# EAGLE design iot_ambilamp (EAGLE 9.1.3)
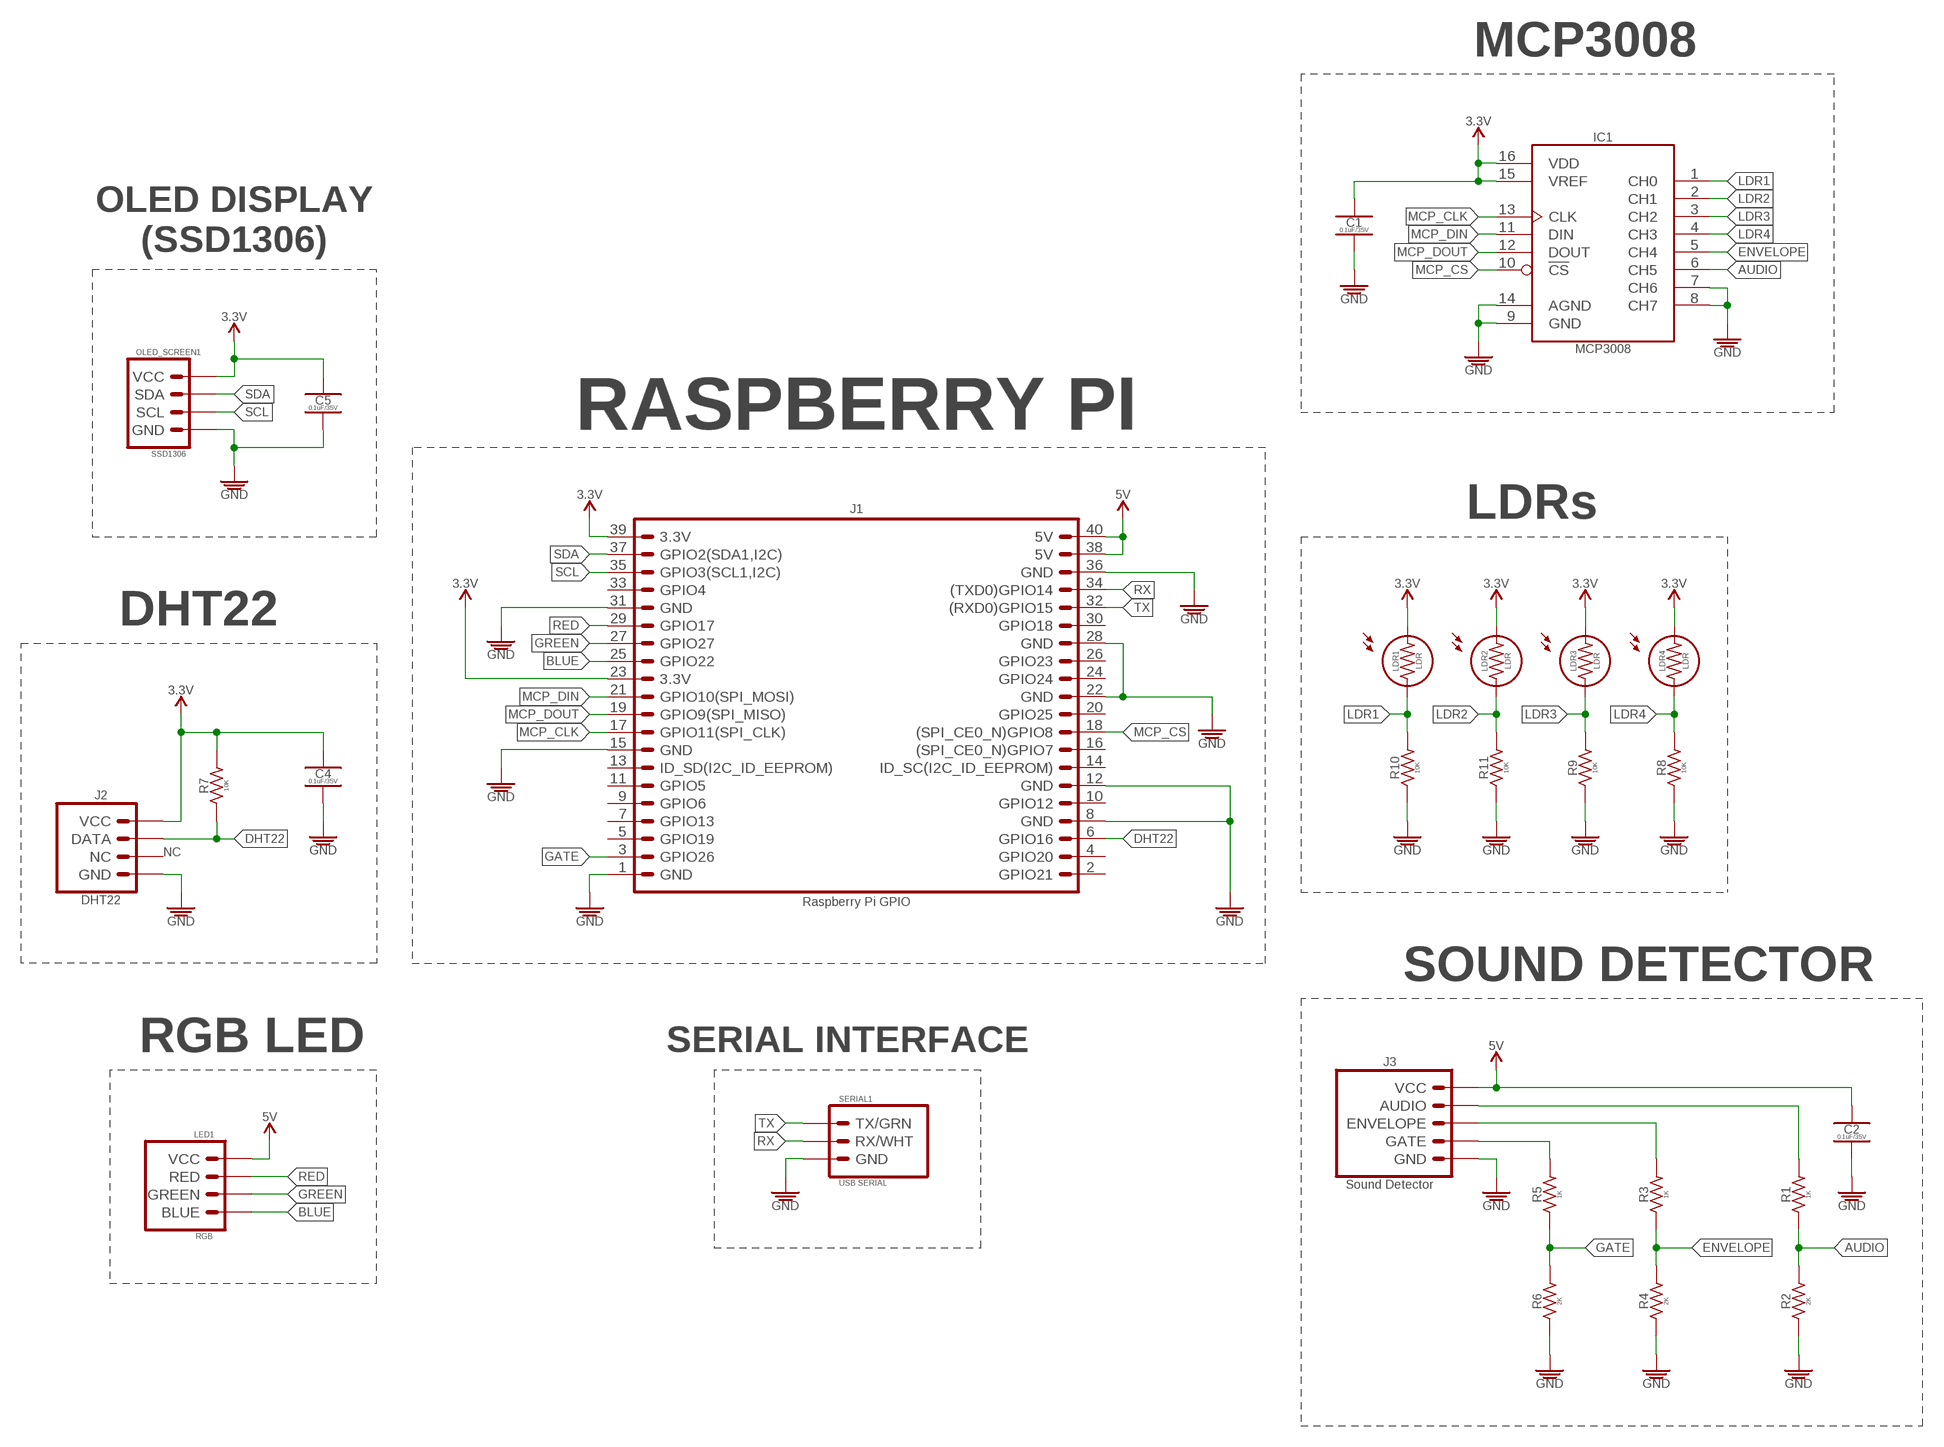
[diagram p0: schematic, sheet 1]

## Parts
C1  0.1uF/35V  0.1UF_SMD-0805_35V-10%  [CAPC2012X95_SMD-0805]
C2  0.1uF/35V  0.1UF_SMD-0805_35V-10%  [CAPC2012X95_SMD-0805]
C4  0.1uF/35V  0.1UF_SMD-0805_35V-10%  [CAPC2012X95_SMD-0805]
C5  0.1uF/35V  0.1UF_SMD-0805_35V-10%  [CAPC2012X95_SMD-0805]
IC1  MCP3008  MCP3008_ADC_8-CH_10-BIT_SOIC-16  [SOIC127P600X175-16]
J1  Raspberry Pi GPIO  RPI-GPIO_CONNECTOR_PTH_VERT_FEMALE_2.54MM  [HDRVR40W64P254_2X20_5130X500X1350B]
J2  DHT22  TEMPERATURE-SENSOR_DHT22_DHT22_AM2302_TEMPERATURE-HUMIDITY  [TEMPERATURE-SENSOR_DHT22]
J3  Sound Detector  SOUND-DETECTOR_SPARKFUN_BREAKOUT_PTH_VERT_MALE_2.54MM  [HDRV5W64P254_1X5_1270X254X838B]
LDR1  LDR  PHOTORESISTOR_5MM_TALL  [PHOTORESISTOR_TALL]
LDR2  LDR  PHOTORESISTOR_5MM_TALL  [PHOTORESISTOR_TALL]
LDR3  LDR  PHOTORESISTOR_5MM_TALL  [PHOTORESISTOR_TALL]
LDR4  LDR  PHOTORESISTOR_5MM_TALL  [PHOTORESISTOR_TALL]
LED1  RGB  LED-5MM-PTH_RGB-CA_PTH_VERT_FEMALE_2.54MM  [HDRVR4W75P254_1X4_1066X254X850B]
OLED_SCREEN1  SSD1306  SSD1306_OLED_SCREEN_0.96IN_W128-H64_PTH_VERT_MALE_2.54MM  [HDRV4W64P254_1X4_1016X254X838B]
R1  1K  1KΩ_SMD-0805_1/8W-5%  [RESC2012X60_SMD-0805]
R2  2K  2KΩ_SMD-0805_1.8W-5%  [RESC2012X60_SMD-0805]
R3  1K  1KΩ_SMD-0805_1/8W-5%  [RESC2012X60_SMD-0805]
R4  2K  2KΩ_SMD-0805_1.8W-5%  [RESC2012X60_SMD-0805]
R5  1K  1KΩ_SMD-0805_1/8W-5%  [RESC2012X60_SMD-0805]
R6  2K  2KΩ_SMD-0805_1.8W-5%  [RESC2012X60_SMD-0805]
R7  10K  10KΩ_SMD-0805_1/8W-5%  [RESC2012X60_SMD-0805]
R8  10K  10KΩ_SMD-0805_1/8W-5%  [RESC2012X60_SMD-0805]
R9  10K  10KΩ_SMD-0805_1/8W-5%  [RESC2012X60_SMD-0805]
R10  10K  10KΩ_SMD-0805_1/8W-5%  [RESC2012X60_SMD-0805]
R11  10K  10KΩ_SMD-0805_1/8W-5%  [RESC2012X60_SMD-0805]
SERIAL1  USB SERIAL  USB_SERIAL_CABLE_PL-2303_3.3V_PTH_VERT_MALE_2.54MM_NO-PWR  [HDRV3W64P254_1X3_762X254X838B_USB-SERIAL-CABLE]

## Nets
3.3V: C1.1 C4.1 C5.1 IC1.15(VREF) IC1.16(VDD) J1.23(3.3V) J1.39(3.3V) J2.VCC LDR1.P$2 LDR2.P$2 LDR3.P$2 LDR4.P$2 OLED_SCREEN1.VCC R7.2
5V: C2.1 J1.38(5V) J1.40(5V) J3.VCC LED1.VCC
AUDIO: IC1.6(CH5) R1.1 R2.2
BLUE: J1.25(GPIO22) LED1.BLUE
DHT22: J1.6(GPIO16) J2.DATA R7.1
ENVELOPE: IC1.5(CH4) R3.1 R4.2
GATE: J1.3(GPIO26) R5.1 R6.2
GND: C1.2 C2.2 C4.2 C5.2 IC1.7(CH6) IC1.8(CH7) IC1.9(GND) IC1.14(AGND) J1.1(GND) J1.8(GND) J1.12(GND) J1.15(GND) J1.22(GND) J1.28(GND) J1.31(GND) J1.36(GND) J2.GND J3.GND OLED_SCREEN1.GND R2.1 R4.1 R6.1 R8.1 R9.1 R10.1 R11.1 SERIAL1.GND
GREEN: J1.27(GPIO27) LED1.GREEN
LDR1: IC1.1(CH0) LDR1.P$1 R10.2
LDR2: IC1.2(CH1) LDR2.P$1 R11.2
LDR3: IC1.3(CH2) LDR3.P$1 R9.2
LDR4: IC1.4(CH3) LDR4.P$1 R8.2
MCP_CLK: IC1.13(CLK) J1.17(GPIO11(SPI_CLK))
MCP_CS: IC1.10(!CS) J1.18((SPI_CE0_N)GPIO8)
MCP_DIN: IC1.11(DIN) J1.21(GPIO10(SPI_MOSI))
MCP_DOUT: IC1.12(DOUT) J1.19(GPIO9(SPI_MISO))
N$9: J3.AUDIO R1.2
N$13: J3.ENVELOPE R3.2
N$14: J3.GATE R5.2
RED: J1.29(GPIO17) LED1.RED
RX: J1.34((TXD0)GPIO14) SERIAL1.RX/WHT
SCL: J1.35(GPIO3(SCL1,I2C)) OLED_SCREEN1.SCL
SDA: J1.37(GPIO2(SDA1,I2C)) OLED_SCREEN1.SDA
TX: J1.32((RXD0)GPIO15) SERIAL1.TX/GRN
Unconnected: J1.2(GPIO21) J1.4(GPIO20) J1.5(GPIO19) J1.7(GPIO13) J1.9(GPIO6) J1.10(GPIO12) J1.11(GPIO5) J1.13(ID_SD(I2C_ID_EEPROM)) J1.14(ID_SC(I2C_ID_EEPROM)) J1.16((SPI_CE0_N)GPIO7) J1.20(GPIO25) J1.24(GPIO24) J1.26(GPIO23) J1.30(GPIO18) J1.33(GPIO4) J2.NC

## Notes on the sheet
- MCP3008
- OLED DISPLAY
  (SSD1306)
- RASPBERRY PI
- LDRs
- DHT22
- SOUND DETECTOR
- RGB LED | SERIAL INTERFACE

## Library data of the parts
C1 C2 C4 C5 = PiB_capacitors:0.1UF; DATASHEET: http://ds.yuden.co.jp/TYCOMPAS/ut/detail.do?productNo=GMK212BJ104KGHT&fileName=GMK212BJ104KGHT_SS&mode=specSheetDownload; DIST: Digikey; DISTLINK: https://www.digikey.com/products/en?keywords=587-3364-1-ND; DISTPN: 587-3364-1-ND; MFR: Taiyo Yuden; MPN: GMK212BJ104KGHT
IC1 = PiB:MCP3008; DATASHEET: http://ww1.microchip.com/downloads/en/DeviceDoc/21295d.pdf; DIST: Digikey; DISTLINK: https://www.digikey.com/products/en?keywords=MCP3008-I%2FSL-ND; DISTPN: MCP3008-I/SL-ND; MFR: Microchip Technology; MPN: MCP3008-I/SL
J1 = PiB_connectors:RPI-GPIO_CONNECTOR; DATASHEET: https://cdn.sparkfun.com/datasheets/Dev/RaspberryPi/12313.pdf; DIST: Digikey; DISTLINK: https://www.digikey.com/products/en?keywords=1568-1462-ND; DISTPN: 1568-1462-ND; MFR: SparkFun Electronics; MPN: PRT-14017
J2 = PiB_sensors:TEMPERATURE-SENSOR_DHT22; DATASHEET: https://cdn-learn.adafruit.com/downloads/pdf/dht.pdf; DIST: Digikey; DISTLINK: https://www.digikey.com/products/en?keywords=1528-1504-ND; DISTPN: 1528-1504-ND; MFR: Adafruit Industries LLC; MPN: 385
J3 = PiB_sound:SOUND-DETECTOR_SPARKFUN; DATASHEET: https://media.digikey.com/pdf/Data%20Sheets/Sparkfun%20PDFs/SoundDetector_HookupGuide.pdf; DATASHEET_CONNECTOR: https://drawings-pdf.s3.amazonaws.com/C10436.pdf; DIST: Digikey; DISTLINK: https://www.digikey.com/products/en?keywords=1568-1290-ND; DISTLINK_CONNECTOR: https://www.digikey.com/products/en?keywords=PEC05SAAN; DISTPN: 1568-1290-ND; DISTPN_CONNECTOR: S1012E-05-ND; DIST_CONNECTOR: Digikey; MFR: SparkFun Electronics; MFR_CONNECTOR: Sullins Connector Solutions; MPN: SEN-12642; MPN_CONNECTOR: PEC05SAAN
LDR1-LDR4 = PiB_sensors:PHOTORESISTOR; DATASHEET: https://cdn-learn.adafruit.com/downloads/pdf/photocells.pdf; DIST: Digikey; DISTLINK: https://www.digikey.com/products/en?keywords=1528-2141-ND; DISTPN: 1528-2141-ND; MFR: Adafruit Industries LLC; MPN: 161
LED1 = PiB_leds:LED-5MM-PTH_RGB-CA; DATASHEET: N/A; DATASHEET_CONNECTOR: https://drawings-pdf.s3.amazonaws.com/10492.pdf; DIST: Amazon; DISTLINK: https://www.amazon.com/Tricolor-Multicolor-Lighting-Electronics-Components/dp/B01C19ENFK/ref=sr_1_1?ie=UTF8&qid=1504314575&sr=8-1&keywords=RGB+Clear+Common+Anode; DISTLINK_CONNECTOR: https://www.digikey.com/products/en?mpart=PPPC041LFBN-RC&v=35; DISTPN: B01C19ENFK; DISTPN_CONNECTOR: S7037-ND; DIST_CONNECTOR: Digikey; MFR: Chanzon; MFR_CONNECTOR: Sullins Connector Solutions; MPN: 100F5T-YT-RGB-CA; MPN_CONNECTOR: PPPC041LFBN-RC
OLED_SCREEN1 = PiB_displays:SSD1306_OLED_SCREEN; DATASHEET: https://cdn-shop.adafruit.com/datasheets/SSD1306.pdf; DATASHEET_CONNECTOR: https://drawings-pdf.s3.amazonaws.com/C10436.pdf; DIST: Amazon; DISTLINK: https://www.amazon.com/Serial-Display-Module-Arduino-MakerFocus/dp/B076WXR8N9/ref=sr_1_4?s=electronics&ie=UTF8&qid=1522732901&sr=1-4&keywords=0.96+inch+OLED+Display+Module; DISTLINK_CONNECTOR: https://www.digikey.com/products/en?keywords=PEC04SAAN; DISTPN: B076WXR8N9; DISTPN_CONNECTOR: S1012E-04-ND; DIST_CONNECTOR: Digikey; MFR: Makerfocus; MFR_CONNECTOR: Sullins Connector Solutions; MPN: SSD1306; MPN_CONNECTOR: PEC04SAAN
R1 R3 R5 = PiB_resistors:1KΩ; DATASHEET: http://www.yageo.com/documents/recent/PYu-RC_Group_51_RoHS_L_9.pdf; DIST: Digikey; DISTLINK: https://www.digikey.com/products/en?keywords=311-1.0KARCT-ND; DISTPN: 311-1.0KARCT-ND; MFR: Yageo; MPN: RC0805JR-071KL
R2 R4 R6 = PiB_resistors:2KΩ; DATASHEET: http://www.yageo.com/documents/recent/PYu-RC_Group_51_RoHS_L_9.pdf; DIST: Digikey; DISTLINK: https://www.digikey.com/products/en?keywords=311-2.0KARCT-ND; DISTPN: 311-2.0KARCT-ND; MFR: Yageo; MPN: RC0805JR-072KL
R7-R11 = PiB_resistors:10KΩ; DATASHEET: http://www.yageo.com/documents/recent/PYu-RC_Group_51_RoHS_L_9.pdf; DIST: Digikey; DISTLINK: https://www.digikey.com/products/en?keywords=311-10KARCT-ND; DISTPN: 311-10KARCT-ND; MFR: Yageo; MPN: RC0805JR-0710KL
SERIAL1 = PiB_connectors:USB_SERIAL_CABLE; DATASHEET: https://media.digikey.com/pdf/Data%20Sheets/Adafruit%20PDFs/954_Web.pdf; DATASHEET_CONNECTOR: https://drawings-pdf.s3.amazonaws.com/C10436.pdf; DIST: Digikey; DISTLINK: https://www.digikey.com/products/en?keywords=1528-2128-ND; DISTLINK_CONNECTOR: https://www.digikey.com/products/en?keywords=PEC03SAAN; DISTPN: 1528-2128-ND; DISTPN_CONNECTOR: S1012E-03-ND; DIST_CONNECTOR: Digikey; MFR: Adafruit Industries LLC; MFR_CONNECTOR: Sullins Connector Solutions; MPN: 954; MPN_CONNECTOR: PEC03SAAN

## Board
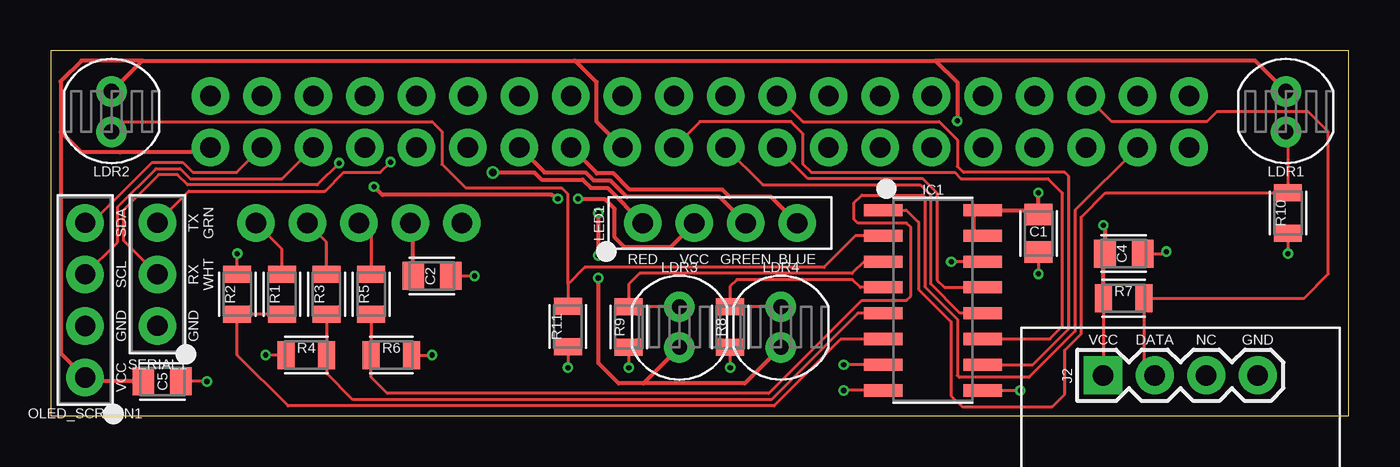
[diagram p1: board, top side]
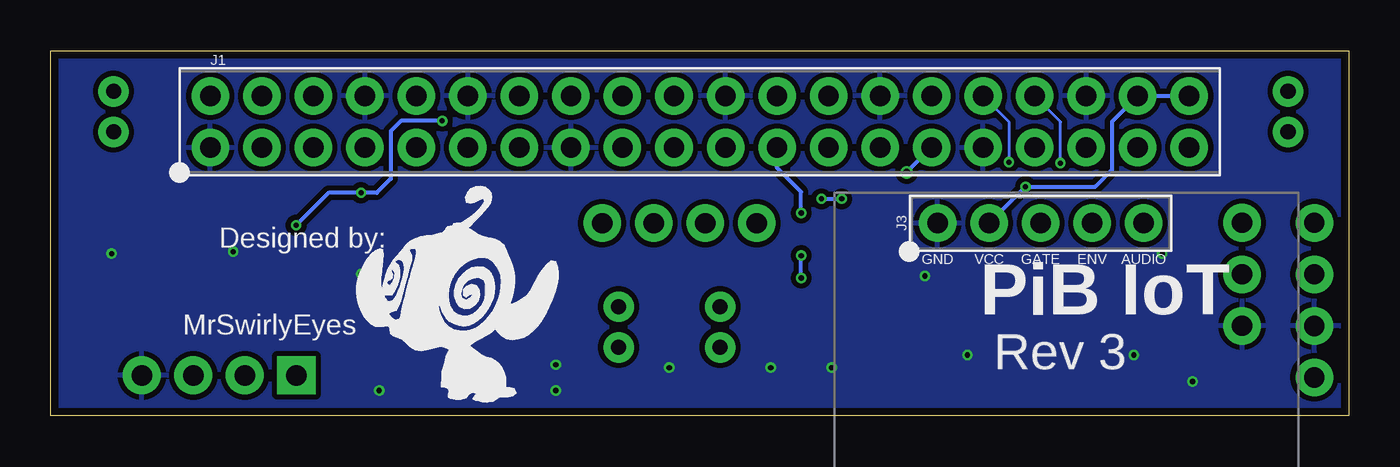
[diagram p2: board, bottom side, seen from below]

Size 64 x 18 mm. Coordinates in mm from the lower left corner, seen from the top.
Outline: 64,0 64,18 0,18 0,0 64,0
Copper layers (1*16): Top 0.035559375mm / dielectric 1.6mm / Bottom 0.035559375mm
Design rules "oshpark-2layer": minimum track width 6mil, minimum drill 10mil, track to track 6mil, track to pad 6mil, pad to pad 6mil, via to via 6mil, smd to smd 6mil, copper to edge 15mil, drill to drill 6mil, minimum pad ring 5mil, minimum via ring 5mil, stop-mask expansion 2.5mil, vias tented up to drill 0mil, thermal gap 10mil

### Footprints (pad centres in the part's own frame; a part is rotated, then mirrored left to right if it is on the bottom)
CAPC2012X95_SMD-0805 = smd 1.065 x 1.379: 1 -0.925,0; 2 0.925,0
SOIC127P600X175-16 = smd 1.901 x 0.599: 1 -2.455,4.445; 2 -2.455,3.175; 3 -2.455,1.905; 4 -2.455,0.635; 5 -2.455,-0.635; 6 -2.455,-1.905; 7 -2.455,-3.175; 8 -2.455,-4.445; 9 2.455,-4.445; 10 2.455,-3.175; 11 2.455,-1.905; 12 2.455,-0.635; 13 2.455,0.635; 14 2.455,1.905; 15 2.455,3.175; 16 2.455,4.445
HDRVR40W64P254_2X20_5130X500X1350B = drill 1 pad 1.85: 1 0,0; 2 0,2.54; 3 2.54,0; 4 2.54,2.54; 5 5.08,0; 6 5.08,2.54; 7 7.62,0; 8 7.62,2.54; 9 10.16,0; 10 10.16,2.54; 11 12.7,0; 12 12.7,2.54; 13 15.24,0; 14 15.24,2.54; 15 17.78,0; 16 17.78,2.54; 17 20.32,0; 18 20.32,2.54; 19 22.86,0; 20 22.86,2.54; 21 25.4,0; 22 25.4,2.54; 23 27.94,0; 24 27.94,2.54; 25 30.48,0; 26 30.48,2.54; 27 33.02,0; 28 33.02,2.54; 29 35.56,0; 30 35.56,2.54; 31 38.1,0; 32 38.1,2.54; 33 40.64,0; 34 40.64,2.54; 35 43.18,0; 36 43.18,2.54; 37 45.72,0; 38 45.72,2.54; 39 48.26,0; 40 48.26,2.54
TEMPERATURE-SENSOR_DHT22 = drill 1.016 pad 1.88: DATA -1,1.27; GND -1,-3.81; NC -1,-1.27 | drill 1.016 pad 1.88 square: VCC -1,3.81
HDRV5W64P254_1X5_1270X254X838B = drill 1 pad 1.85: AUDIO 10.16,0; ENVELOPE 7.62,0; GATE 5.08,0; GND 0,0; VCC 2.54,0
PHOTORESISTOR_TALL = drill 0.75 pad 1.5: P$1 0,1; P$2 0,-1
HDRVR4W75P254_1X4_1066X254X850B = drill 1 pad 1.85: BLUE 7.62,0; GREEN 5.08,0; RED 0,0; VCC 2.54,0
HDRV4W64P254_1X4_1016X254X838B = drill 1 pad 1.85: GND 2.54,0; SCL 5.08,0; SDA 7.62,0; VCC 0,0
RESC2012X60_SMD-0805 = smd 0.838 x 1.379: 1 -0.995,0; 2 0.995,0
HDRV3W64P254_1X3_762X254X838B_USB-SERIAL-CABLE = drill 1 pad 1.85: GND 0,0; RX/WHT 2.54,0; TX/GRN 5.08,0

### Placement (x,y rotation side)
C1  48.7,9 270 top
C2  18.8,6.9 0 top
C4  52.9,8 0 top
C5  5.5,1.7 0 top
IC1  43.5,5.7 0 top
J1  56.13,13.23 0 bottom
J2  55.7,3 90 top
J3  20.27,9.5 0 bottom
LDR1  60.9,15 180 top
LDR2  3,15 180 top
LDR3  31,4.38 0 top
LDR4  36,4.38 0 top
LED1  29.19,9.5 0 top
OLED_SCREEN1  1.7,1.9 90 top
R1  11.4,6 90 top
R2  9.2,6 270 top
R3  13.6,6 90 top
R4  12.6,3 0 top
R5  15.8,6 90 top
R6  16.8,3 180 top
R7  52.9,5.8 180 top
R8  33.5,4.38 90 top
R9  28.5,4.38 90 top
R10  61,10 90 top
R11  25.5,4.4 90 top
SERIAL1  5.26,4.44 90 top
U$2  [MRSWIRLYEYES-LOGO]  43.95,6 0 bottom

### Tracks (layer width: path | path; a pad name or v marks a point on that pad's centre or on a via)
3.3V  (via drill 0.25)
  Top 0.152: 51.91,7.93 C4.1 | R7.2 51.91,2.02 J2.VCC
  Top 0.203: IC1.15 45.62,8.88 45.5,9 45.5,10 45.65,10.14 IC1.16 48.55,10.14 C1.1 v48.7,11 | C5.1 1.89,1.7 OLED_SCREEN1.VCC 0.49,3.1 0.49,14 | 0.49,14 0.49,16.49 1.52,17.52 4.52,17.52 | 43.63,17.52 44.7,16.45 v44.7,14.54 | LDR2.P$2 4.52,17.52 | 4.52,17.52 25.85,17.52 | 25.85,17.52 43.63,17.52 | 0.49,14 0.5,14 1.5,13 3.42,13 7.64,13 J1.39 | 25.85,17.52 26.92,16.45 26.92,14.5 J1.23 | LDR4.P$2 34.22,1.6 29.22,1.6 | 29.22,1.6 28,1.6 27,2.6 v27,6.8 | LDR3.P$2 29.22,1.6 | v27,7.9 v27,10 | LDR1.P$2 59.38,17.52 43.63,17.52 | R7.2 51.91,7.93 | v51.9,9.4 51.98,9.32 C4.1
  Bottom 0.203: v51.9,9.4 50.3,11 v48.7,11 47.92,11 47.24,11.68 47.24,14.04 46.73,14.54 v44.7,14.54 | v27,6.8 v27,7.9 | v27,10 27,11.04 28.19,12.23 J1.23
5V  (via drill 0.25)
  Top 0.203: v26,10.7 27.3,10.7 27.8,10.2 27.8,8.8 28.28,8.32 30.55,8.32 LED1.VCC | v15.94,11.3 16.34,10.9 24.71,10.9 v25,10.7 | C2.1 17.88,9.36 J3.VCC
  Bottom 0.203: J1.40 J1.38 11.68,14.5 11.68,12.13 12.51,11.3 v15.94,11.3 J3.VCC | v26,10.7 v25,10.7
AUDIO
  Top 0.152: R1.1 R2.2 9.2,3 11.7,0.5 35.66,0.5 38.96,3.79 IC1.6
BLUE
  Top 0.203: LED1.BLUE 35.51,10.8 33.47,10.8 33.12,11.16 28.54,11.16 27.74,11.96 26.92,11.96 J1.25
DHT22
  Top 0.152: J1.6 52.32,14.5 57,14.5 57.5,15 62,15 63,14 63,7 61.8,5.8 R7.1 53.9,2.54 J2.DATA
ENVELOPE
  Top 0.152: R3.1 R4.2 13.6,2.1 14.89,0.81 35.54,0.81 39.8,5.07 IC1.5
GATE
  Top 0.152: R5.1 R6.2 15.8,1.9 16.59,1.11 35.41,1.11 40,5.7 42.2,5.7 42.4,5.9 42.4,9.3 42.2,9.5 39.8,9.5 39.6,9.7 39.6,10.5 39.99,10.89 42.95,10.89 43.09,10.74 43.09,6.38 44.7,4.77 44.7,2 44.8,1.9 48.23,1.9 50.5,4.17 50.5,10.14 J1.3
GND  (via drill 0.25)
  Top 0.152: C2.2 v20.9,6.9 | R4.1 v10.6,3 | R6.1 v18.8,3 | R10.1 v61,8 | C4.2 54.9,8 v55,8.1 | C1.2 v48.7,7 | IC1.9 v47.8,1.25 | IC1.8 v39.1,1.25 | R8.1 v33.5,2.38 | R9.1 v28.5,2.38 | R11.1 v25.5,2.38 | R2.1 v9.2,8 | IC1.7 v39.1,2.52 | v7.7,1.7 C5.2 | IC1.14 v44.41,7.61 v44.4,7.6
  pour Bottom (isolate 0.254): 0,0 0,18 64,18 64,0
GREEN
  Top 0.203: J1.27 24.34,12 26.38,12 26.78,11.6 27.59,11.6 28.39,10.8 32.97,10.8 LED1.GREEN
LDR1
  Top 0.152: LDR1.P$1 61,13.9 R10.2 52,10.99 50.8,9.8 50.8,4.04 50,3.24 50,1.07 49.38,0.46 44.94,0.46 44.4,1 44.4,4.64 42.79,6.25 42.79,9.55 42.19,10.14 IC1.1
LDR2
  Top 0.152: 25.5,6.5 R11.2 | LDR2.P$1 3.5,14.5 18.8,14.5 19.3,14 19.3,12.4 20.47,11.23 25.2,11.23 25.5,10.93 25.5,6.5 | IC1.2 39.67,8.88 38.13,7.33 26.33,7.33 25.5,6.5
LDR3
  Top 0.152: LDR3.P$1 R9.2 28.5,6.48 29.04,7.02 39.51,7.02 40.1,7.61 IC1.3
LDR4
  Top 0.152: LDR4.P$1 R8.2 33.5,6.38 33.84,6.72 39.54,6.72 39.92,6.33 IC1.4
MCP_CLK
  Top 0.152: IC1.13 44.06,6.33 43.7,6.7 43.7,10.99 43,11.7 37.34,11.7 J1.17
MCP_CS
  Top 0.152: J1.18 37.08,14.5 43.81,14.5 44.7,13.62 44.7,12.3 45,12 50,12 50.2,11.8 50.2,4.29 48.42,2.52 IC1.10
MCP_DIN
  Top 0.152: J1.21 32,14.5 36.5,14.5 37.1,13.9 37.1,12.4 37.5,12 44.57,12 44.87,11.7 49.17,11.7 49.89,10.98 49.89,4.42 49.26,3.79 IC1.11
MCP_DOUT
  Top 0.152: IC1.12 44.84,5.07 43.4,6.5 43.4,10.87 42.87,11.39 35.11,11.39 J1.19
N$9
  Top 0.152: R1.2 11.4,8.22 J3.AUDIO
N$13
  Top 0.152: R3.2 13.6,8.56 J3.ENVELOPE
N$14
  Top 0.152: J3.GATE 15.8,8.9 R5.2
RED  (via drill 0.35)
  Top 0.203: LED1.RED 27.45,11.24 26.63,11.24 26.23,11.64 24.19,11.64 23.84,12 v21.8,12
  Bottom 0.203: J1.29 v21.8,12
RX  (via drill 0.25)
  Top 0.152: v14.22,12.46 13.14,11.39 6.75,11.39 6.25,11.89 5.32,11.89 3.6,10.17 3.6,8.64 SERIAL1.RX/WHT
  Bottom 0.152: v14.22,12.46 14.22,14.5 J1.34
SCL
  Top 0.152: OLED_SCREEN1.SCL 3.3,8.57 3.3,10.3 5.2,12.2 | 5.2,12.2 | 5.2,12.2 6.37,12.2 6.87,11.7 11.41,11.7 J1.35
SDA
  Top 0.152: OLED_SCREEN1.SDA 1.86,9.36 5,12.5 6.5,12.5 7,12 9.18,12 J1.37
TX  (via drill 0.25)
  Top 0.152: v16.76,12.51 16.25,12 14.44,12 13.52,11.09 6.81,11.09 SERIAL1.TX/GRN
  Bottom 0.152: J1.32 16.76,14.5 v16.76,12.51

### Text on the board
bPlace: Designed by: | PiB IoT | MrSwirlyEyes | Rev 3